# Altium schematic sheet Display.SchDoc
size A4
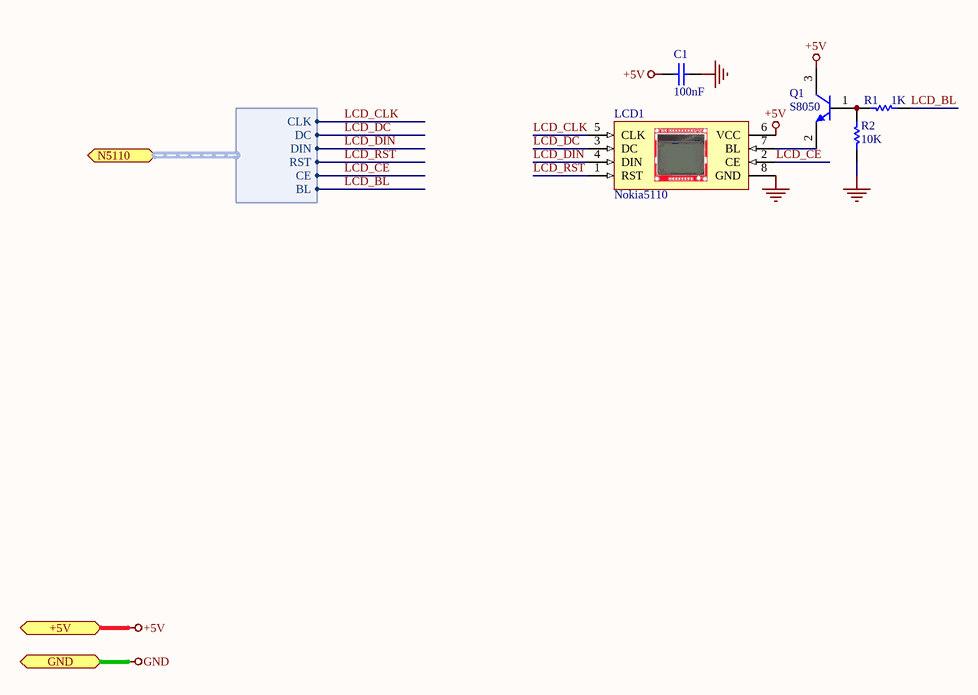
[diagram p0: Display.SchDoc]

## Parts
C1  value 100nF  [C-0805]  (hidden comment: 104)
LCD1  value Nokia5110  [LCD-N5110]  (hidden comment: LCD-N5110)
Q1  S8050  [SOT-23-3]
R1  1K  [R-0805]
R2  10K  [R-0805]

## Ports
+5V, GND, N5110 (harness N5110LCD)

## Harnesses
N5110LCD: CLK, DC, DIN, RST, CE, BL

## Nets
+5V: C1.1 LCD1.6(VCC) Q1.3(C) ; port +5V
GND: C1.2 LCD1.8(GND) R2.1 ; port GND
LCD_BL: R1.2 ; port N5110.BL
LCD_CE: LCD1.2(CE) ; port N5110.CE
LCD_CLK: LCD1.5(CLK) ; port N5110.CLK
LCD_DC: LCD1.3(DC) ; port N5110.DC
LCD_DIN: LCD1.4(DIN) ; port N5110.DIN
LCD_RST: LCD1.1(RST) ; port N5110.RST
NetLCD1_7: LCD1.7(BL) Q1.2(E)
NetQ1_1: Q1.1(B) R1.1 R2.2

## Library data of the parts
C1 = Cap: Capacitor; Published: 8-Jun-2000; LatestRevisionDate: 17-Jul-2002; LatestRevisionNote: Re-released for DXP Platform.; PackageReference: RAD-0.3; Publisher: Altium Limited; PackageDescription: Radial Cap, Thru-Hole; 2 Leads; 0.3 in Pin Spacing
Q1 = NPN: NPN Bipolar Transistor; Published: 8-Jun-2000; LatestRevisionDate: 17-Jul-2002; LatestRevisionNote: Re-released for DXP Platform.; PackageReference: TO-226-AA; Value: S8050; PackageDescription: TO, Flat Index; 3 In-Line, Axial Leads; Body Dia. 4.8mm; Leads 0.55 x 0.51 mm (max); Code_JEDEC: TO-226-AA
R1 R2 = Res1: Resistor; Published: 8-Jun-2000; LatestRevisionDate: 17-Jul-2002; LatestRevisionNote: Re-released for DXP Platform.; PackageReference: AXIAL-0.3; Publisher: Altium Limited; PackageDescription: Axial Device, Thru-Hole; 2 Leads; 0.3 in Pin Spacing
  R1: Value: 1K
  R2: Value: 10K